# Altium schematic sheet mic.SchDoc
size A
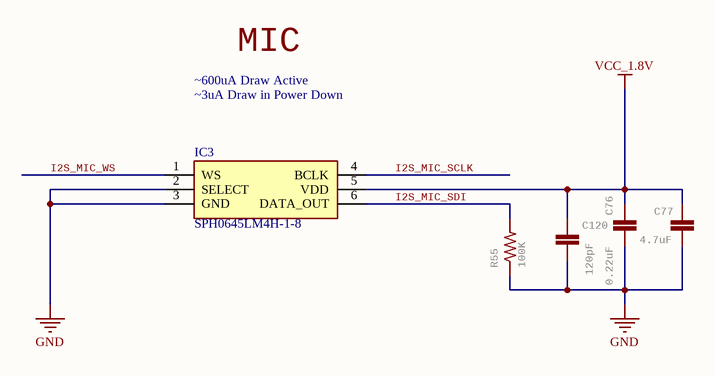
[diagram p0: mic.SchDoc]

## Parts
C76  0.22uF  [C0201]
C77  4.7uF  [0402-CAP]
C120  120pF  [C0201]
IC3  SPH0645LM4H-1-8  [SPH0645LM4H18]
R55  100K  [R0201]

## Nets
GND: C76.2 C77.1 C120.1 IC3.2(SELECT) IC3.3(GND) R55.1
VCC_1.8V: C76.1 C77.2 C120.2 IC3.5(VDD)
I2S_MIC_SCLK: IC3.4(BCLK)
I2S_MIC_SDI: IC3.6(DATA_OUT) R55.2
I2S_MIC_WS: IC3.1(WS)

## Notes on the sheet
- ~3uA Draw in Power Down
- ~600uA Draw Active
- MIC

## Library data of the parts
C76 = C-EUC0201: CAPACITOR, European symbol; MPN: GRM033R60J224ME15D; GateName_1: G$1; SymbolName_1: C-EU; POPULARITY: 0; DeviceName: C0201; LibraryName: rcl; DeviceSetName: C-EU; SPICEPREFIX: C; Part Number: GRM033R60J224ME15D
C77 = CAP0402-CAP: CapacitorStandard 0603 ceramic capacitor, and 0.1" leaded capacitor.; MPN: JMK105BBJ475MV-F; GateName_1: G$1; SymbolName_1: CAP; DeviceName: 0402-CAP; LibraryName: sfe; DeviceSetName: CAP; Part Number: JMK105BBJ475MV-F
C120 = CAP0402-CAP: MPN: GRM033R71H121KA12D; GateName_1: G$1; SymbolName_1: CAP; LibraryName: sfe; DeviceSetName: CAP; Part Number: GRM033R71H121KA12D
IC3 = SPH0645LM4H-1-8: Integrated Circuit; Manufacturer_Name: Knowles; Datasheet Link: https://www.knowles.com/docs/default-source/default-document-library/sph0645lm4h-1-datasheet.pdf?Status=Master&sfvrsn=751076b1_2; Height: 1.08mm; Manufacturer_Part_Number: SPH0645LM4H-1-8; Mouser Part Number: 721-SPH0645LM4H-1-8; Mouser Price/Stock: https://www.mouser.co.uk/ProductDetail/Knowles/SPH0645LM4H-1-8?qs=TuK3vfAjtkXP9L009Fh60A%3D%3D; MPN: SPH0645LM4H-1-8; Part Number: SPH0645LM4H-1-8
R55 = RESISTOR0402-RES: MPN: RMCF0201FT100K; GateName_1: G$1; SymbolName_1: RESISTOR; LibraryName: sfe; DeviceSetName: RESISTOR; Part Number: RMCF0201FT100K